# Altium project horn_pcb.PrjPcb
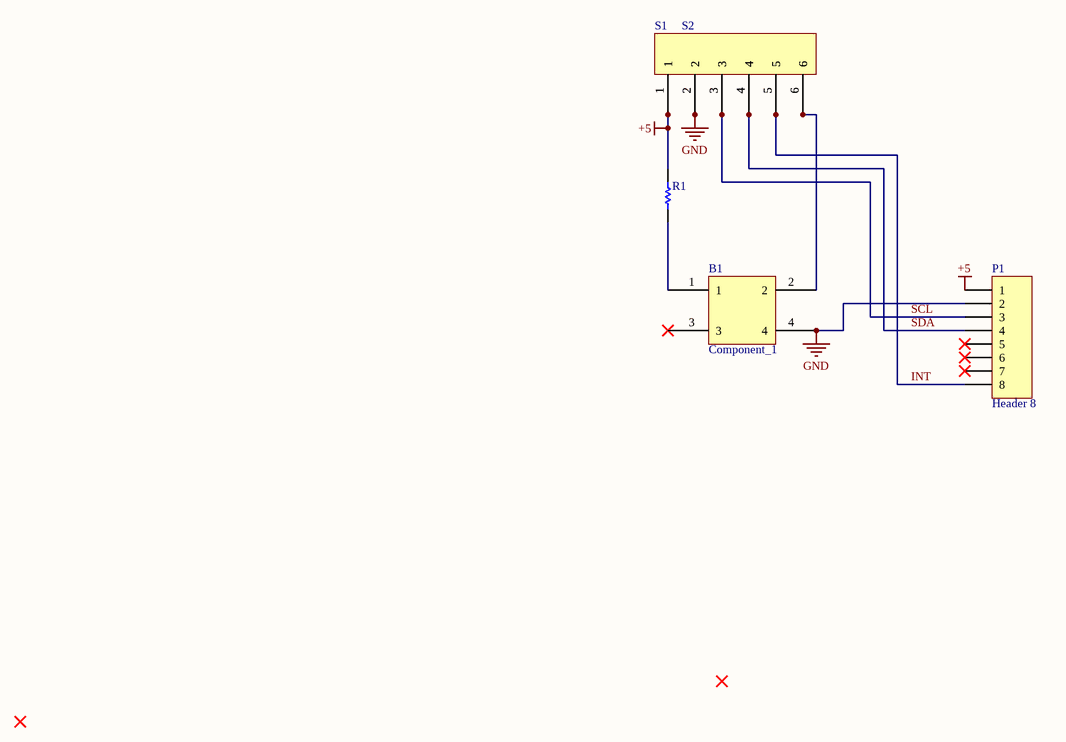
[diagram p0: Sheet1.SchDoc]
1 sheet, 5 parts. Net scope: global (net labels, ports and power ports of the same name join across sheets).
Board file: PCB1.PcbDoc

## Sheet Sheet1.SchDoc
size Tabloid; SheetNumber: 1; SheetTotal: 1

### Parts
B1  Component_1  [PCBComponent_1]
P1  Header 8  [HDR1X8]
R1  (no value)  [OMTE-RES7X2.5-2]
S1  (no value)  [PCBComponent_1]
S2  (no value)  [PCBComponent_1]

### Nets
+5: P1.1 R1.2 S1.1 S2.1
GND: B1.4 P1.2 S1.2 S2.2
INT: P1.8 S1.5 S2.5
SCL: P1.3 S1.3 S2.3
SDA: P1.4 S1.4 S2.4
NetB1_1: B1.1 R1.1
NetB1_2: B1.2 S1.6 S2.6

Not connected (* = marked no-connect by the designer): B1 3*; P1 5* 6* 7*

### Library data of the parts
P1 = Header 8: Header, 8-Pin; LatestRevisionDate: 17-Jul-2002; LatestRevisionNote: Re-released for DXP Platform.; Publisher: Altium Limited
R1 = CMP-2000-06865-1: Little Demon(R) Carbon Composition Molded OD Series, 250 V, 10 KOhm, +/-5%, -70 to 130 degC, 2-Pin THD, RoHS, Bulk; PartNumber: OD103JE; Manufacturer: Ohmite; Resistance (Ohms): 10k; Power Rating: 0.25W; Power (Watts): 0.25W,1/4W; Tolerance: ±5%; Online Catalog: OD,OF,OASeries,LittleDemon®; Catalog Drawings: OD,OF,OASeries; EDA / CAD Models: DownloadfromAcceleratedDesigns; Mounting Technology: ThroughHole; Datasheet Version: 06/2016; RoHS Information: LittleDemon"E"SeriesMaterialDeclaration; Number of Terminations: 2; Temperature Coefficient: -; Height: -; Composition: CarbonComposition; Package Description: 2-Pin THD Resistor, Body 7 x 2.5 mm, Lead Dia. 0.6 mm; Size / Dimension: 0.098"Diax0.276"L(2.50mmx7.00mm); Category: Resistors; Manufacturer URL: http://www.ohmite.com/; Features: PulseWithstanding; Family: ThroughHoleResistors; Supplier Device Package: Axial; Package / Case: Axial; Standard Package: 100; Package Reference: RES7X2.5; Operating Temperature: -; Series: LittleDemon®OD; Datasheet URL: http://www.ohmite.com/cat/res_od_of_oa.pdf; Packaging: Bulk
S1 S2 = Component_1